# Altium schematic sheet 5050 Breakout.SchDoc
size A4
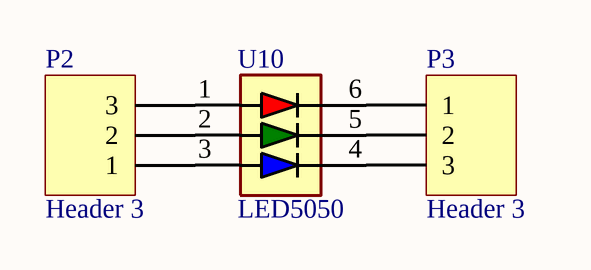
[diagram p0: 5050 Breakout.SchDoc]

## Parts
P2  Header 3  [HDR1X3]
P3  Header 3  [HDR1X3]
U10  LED5050  [SOP6]

## Nets
NetP2_1: P2.1 U10.3
NetP2_2: P2.2 U10.2
NetP2_3: P2.3 U10.1
NetP3_1: P3.1 U10.6
NetP3_2: P3.2 U10.5
NetP3_3: P3.3 U10.4

## Library data of the parts
P2 P3 = Header 3: Header, 3-Pin; LatestRevisionDate: 17-Jul-2002; LatestRevisionNote: Re-released for DXP Platform.; Publisher: Altium Limited
U10 = LED5050: Surfage Mount RGB LED Pack